# Altium schematic sheet EJ1Mealy.SchDoc
size A4
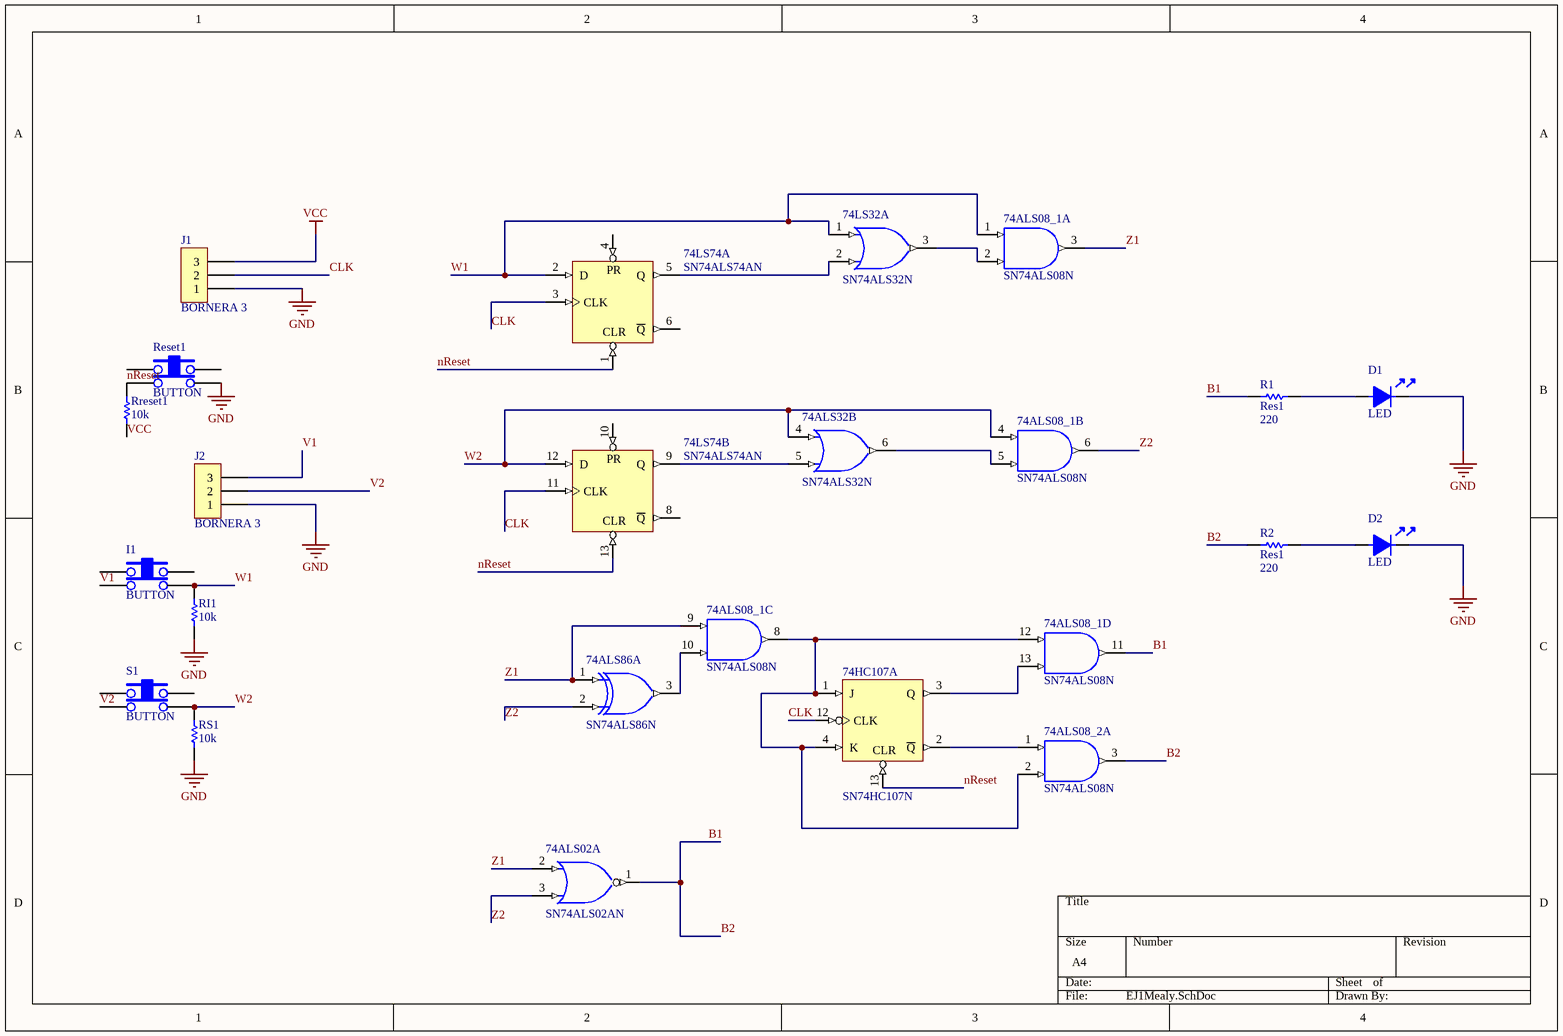
[diagram p0: EJ1Mealy.SchDoc]

## Parts
74ALS02  SN74ALS02AN  [N014]  (part A of 4)
74ALS08_1  SN74ALS08N  [N014]  (parts A,B,C,D of 4)
74ALS08_2  SN74ALS08N  [N014]  (part A of 4)
74ALS32  SN74ALS32N  [N014]  (part B of 4)
74ALS86  SN74ALS86N  [N014]  (part A of 4)
74HC107  SN74HC107N  [N014D]  (part A of 2)
74LS32  SN74ALS32N  [N014]  (part A of 4)
74LS74  SN74ALS74AN  [N014]  (parts A,B of 2)
D1  LED  [LED3]
D2  LED  [LED3]
I1  BUTTON  [TACTSWITCH]
J1  BORNERA 3  [BORNERA3]
J2  BORNERA 3  [BORNERA3]
R1  Res1  value 220  [AXIAL-0.3]
R2  Res1  value 220  [AXIAL-0.3]
Reset1  BUTTON  [TACTSWITCH]
RI1  10k  [RES400]
Rreset1  10k  [RES400]
RS1  10k  [RES400]
S1  BUTTON  [TACTSWITCH]

## Nets
GND: 74ALS02.7(GND) 74ALS08_1.7(GND) 74ALS08_2.7(GND) 74ALS32.7(GND) 74ALS86.7(GND) 74HC107.7(GND) 74LS32.7(GND) 74LS74.7(GND) D1.2 D2.2 J1.1 J2.1 Reset1.4 RI1.1 RS1.1
VCC: 74ALS02.14(VCC) 74ALS08_1.14(VCC) 74ALS08_2.14(VCC) 74ALS32.14(VCC) 74ALS86.14(VCC) 74HC107.14(VCC) 74LS32.14(VCC) 74LS74.14(VCC) J1.3 Rreset1.1
B1: 74ALS02.1(Y) 74ALS08_1.11(Y) 74ALS08_2.3(Y) R1.1 R2.1  [also labelled B2]
CLK: 74HC107.12(CLK) 74LS74.3(CLK) 74LS74.11(CLK) J1.2
nReset: 74HC107.13(CLR) 74LS74.1(CLR) 74LS74.13(CLR) Reset1.2 Rreset1.2
V1: I1.2 J2.3
V2: J2.2 S1.2
W1: 74ALS08_1.1(A) 74LS32.1(A) 74LS74.2(D) I1.4 RI1.2
W2: 74ALS08_1.4(A) 74ALS32.4(A) 74LS74.12(D) RS1.2 S1.4
Z1: 74ALS02.2(A) 74ALS08_1.3(Y) 74ALS08_1.9(A) 74ALS86.1(A)
Z2: 74ALS02.3(B) 74ALS08_1.6(Y) 74ALS86.2(B)
Net74ALS08_1_2: 74ALS08_1.2(B) 74LS32.3(Y)
Net74ALS08_1_5: 74ALS08_1.5(B) 74ALS32.6(Y)
Net74ALS08_1_8: 74ALS08_1.8(Y) 74ALS08_1.12(A) 74ALS08_2.2(B) 74HC107.1(J) 74HC107.4(K)
Net74ALS08_1_10: 74ALS08_1.10(B) 74ALS86.3(Y)
Net74ALS08_1_13: 74ALS08_1.13(B) 74HC107.3(Q)
Net74ALS08_2_1: 74ALS08_2.1(A) 74HC107.2(~{Q})
Net74ALS32_5: 74ALS32.5(B) 74LS74.9(Q)
Net74LS32_2: 74LS32.2(B) 74LS74.5(Q)
NetD1_1: D1.1 R1.2
NetD2_1: D2.1 R2.2

Not connected (* = marked no-connect by the designer): 74LS74 4(PR) 6(~{Q}) 8(~{Q}) 10(PR); I1 1 3; Reset1 1 3; S1 1 3

## Library data of the parts
74ALS02 = SN74ALS02AN: Quadruple 2-Input Positive-NOR Gate; Published: 8-Jun-2000; LatestRevisionDate: 04-Mar-2005; LatestRevisionNote: Stylized 3D Model Added.; DatasheetVersion: Dec-1994; PackageVersion: Oct-1995; PackageReference: N014; Publisher: Altium Limited; PackageDescription: DIP; 14 Leads; Row Spacing 7.62 mm; Pitch 2.54 mm; ComponentLink1Description: Manufacturer Link; ComponentLink1URL: http://www.ti.com/; ComponentLink2Description: Datasheet; ComponentLink2URL: http://www-s.ti.com/sc/ds/sn74als02a.pdf; ComponentLink3Description: Packaging Specification; ComponentLink3URL: http://focus.ti.com/lit/ml/mpdi002c/mpdi002c.pdf
74ALS08_1 74ALS08_2 = SN74ALS08N: Quadruple 2-Input Positive-AND Gate; Published: 8-Jun-2000; LatestRevisionDate: 04-Mar-2005; LatestRevisionNote: Stylized 3D Model Added.; DatasheetVersion: Dec-1994; PackageVersion: Oct-1995; PackageReference: N014; Publisher: Altium Limited; PackageDescription: DIP; 14 Leads; Row Spacing 7.62 mm; Pitch 2.54 mm; ComponentLink1Description: Manufacturer Link; ComponentLink1URL: http://www.ti.com/; ComponentLink2Description: Datasheet; ComponentLink2URL: http://www-s.ti.com/sc/ds/sn74als08.pdf; ComponentLink3Description: Packaging Specification; ComponentLink3URL: http://focus.ti.com/lit/ml/mpdi002c/mpdi002c.pdf
74ALS32 74LS32 = SN74ALS32N: Quadruple 2-Input Positive-OR Gate; Published: 8-Jun-2000; LatestRevisionDate: 04-Mar-2005; LatestRevisionNote: Stylized 3D Model Added.; DatasheetVersion: Dec-1994; PackageVersion: Oct-1995; PackageReference: N014; Publisher: Altium Limited; PackageDescription: DIP; 14 Leads; Row Spacing 7.62 mm; Pitch 2.54 mm; ComponentLink1Description: Manufacturer Link; ComponentLink1URL: http://www.ti.com/; ComponentLink2Description: Datasheet; ComponentLink2URL: http://www-s.ti.com/sc/ds/sn74als32.pdf; ComponentLink3Description: Packaging Specification; ComponentLink3URL: http://focus.ti.com/lit/ml/mpdi002c/mpdi002c.pdf
74ALS86 = SN74ALS86N: Quadruple 2-Input Exclusive-OR Gate; Published: 8-Jun-2000; LatestRevisionDate: 04-Mar-2005; LatestRevisionNote: Stylized 3D Model Added.; DatasheetVersion: Dec-1994; PackageVersion: Oct-1995; PackageReference: N014; Publisher: Altium Limited; PackageDescription: DIP; 14 Leads; Row Spacing 7.62 mm; Pitch 2.54 mm; ComponentLink1Description: Manufacturer Link; ComponentLink1URL: http://www.ti.com/; ComponentLink2Description: Datasheet; ComponentLink2URL: http://www-s.ti.com/sc/ds/sn54als86.pdf; ComponentLink3Description: Packaging Specification; ComponentLink3URL: http://focus.ti.com/lit/ml/mpdi002c/mpdi002c.pdf
74HC107 = SN74HC107N: Dual J-K Negative-Edge-Triggered Flip-Flop with Clear; Published: 8-Jun-2000; LatestRevisionDate: 04-Mar-2005; LatestRevisionNote: Stylized 3D Model Added.; DatasheetVersion: Jun-1989; PackageVersion: Oct-1995; PackageReference: N014D; Publisher: Altium Limited; PackageDescription: DIP; 14 Leads; Row Spacing 7.62 mm; Pitch 2.54 mm; ComponentLink1Description: Manufacturer Link; ComponentLink1URL: http://www.ti.com/
74LS74 = SN74ALS74AN: Dual Positive-Edge-Triggered D-Type Flip-Flop with Clear and Preset; Published: 8-Jun-2000; LatestRevisionDate: 04-Mar-2005; LatestRevisionNote: Stylized 3D Model Added.; DatasheetVersion: Aug-1995; PackageVersion: Oct-1995; PackageReference: N014; Publisher: Altium Limited; PackageDescription: DIP; 14 Leads; Row Spacing 7.62 mm; Pitch 2.54 mm; ComponentLink1Description: Manufacturer Link; ComponentLink1URL: http://www.ti.com/; ComponentLink2Description: Datasheet; ComponentLink2URL: http://www-s.ti.com/sc/ds/sn74als74a.pdf
I1 Reset1 S1 = TACT SWITCH
R1 R2 = Res1: Resistor; Published: 8-Jun-2000; LatestRevisionDate: 17-Jul-2002; LatestRevisionNote: Re-released for DXP Platform.; PackageReference: AXIAL-0.3; Publisher: Altium Limited; PackageDescription: Axial Device, Thru-Hole; 2 Leads; 0.3 in Pin Spacing
RI1 Rreset1 RS1 = RES